# EAGLE design ESC (EAGLE 9.1.2)
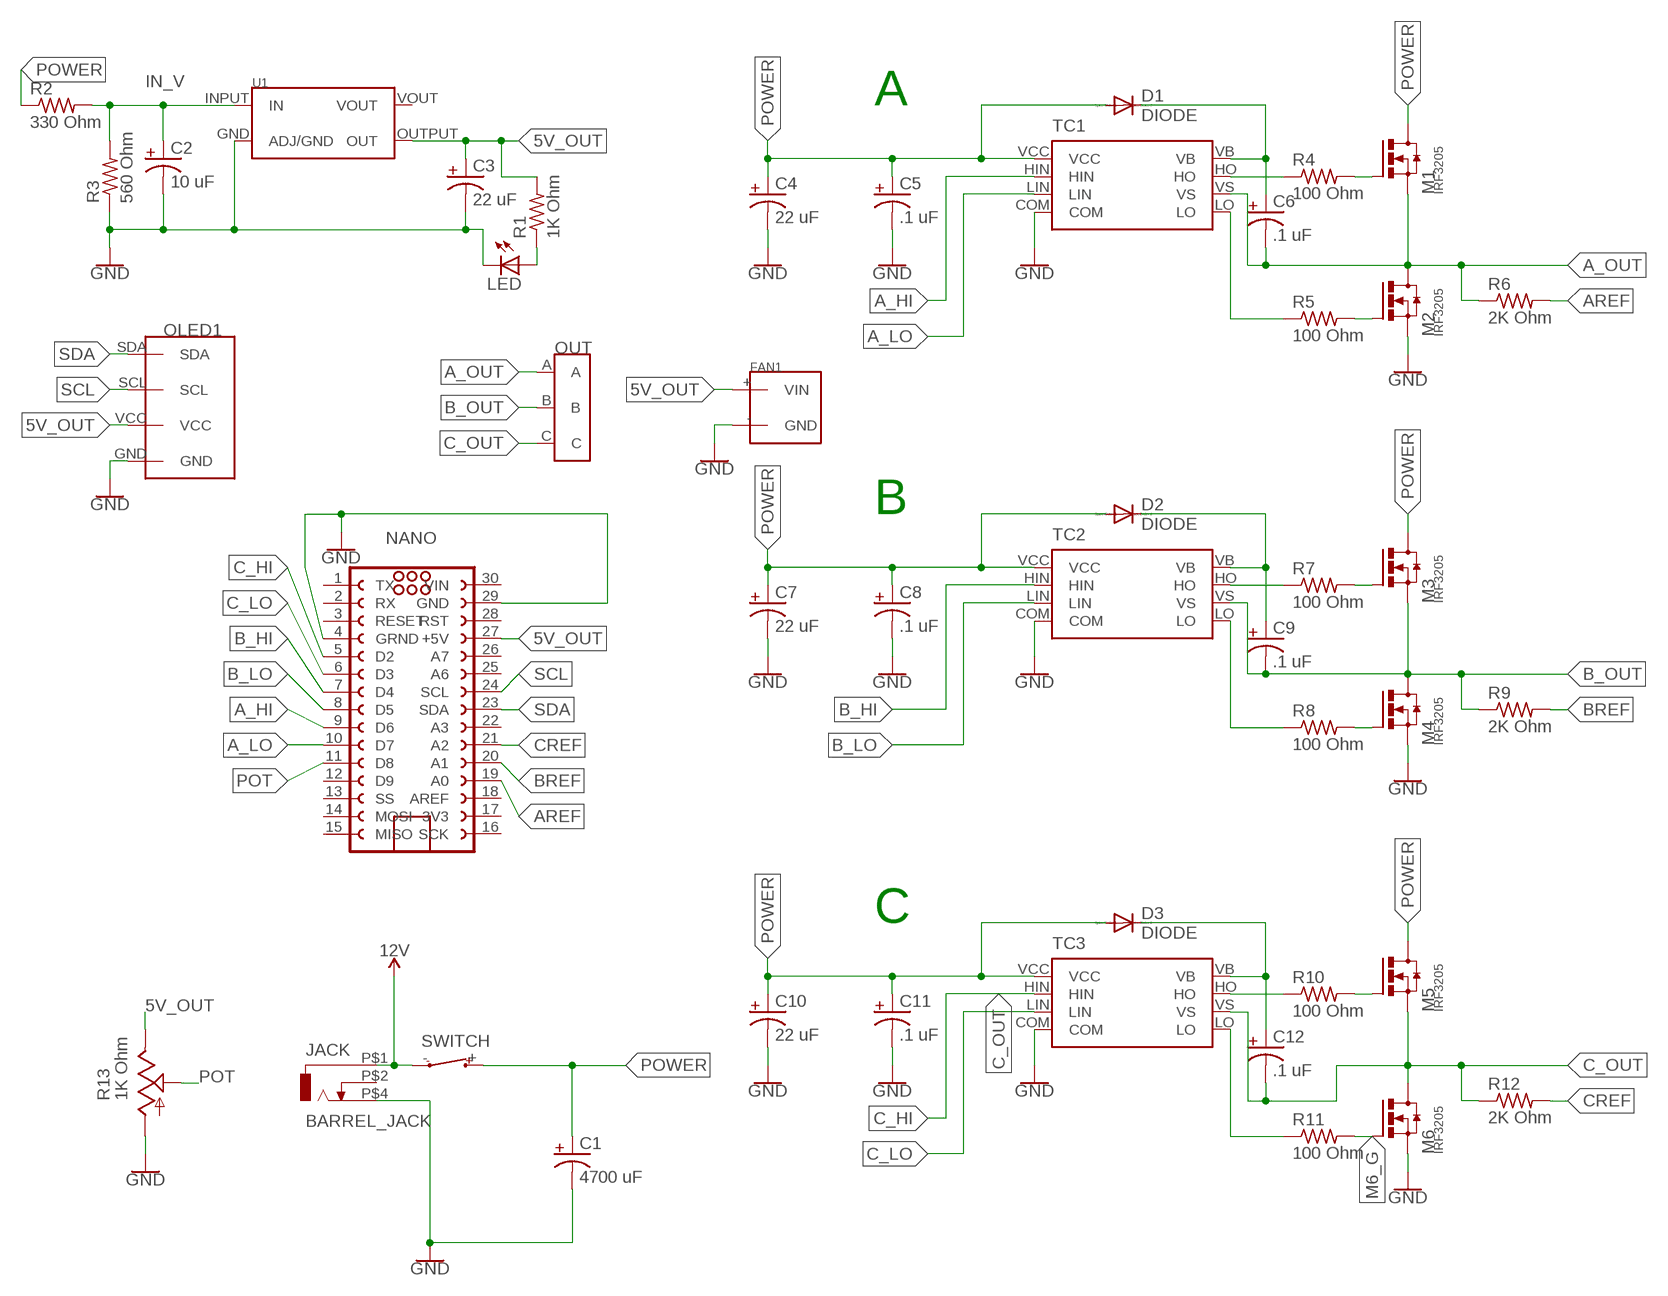
[diagram p0: schematic, sheet 1]

## Parts
C1  4700 uF  CAPACITORLARGE  [CAP_LARGE]
C2  10 uF  CAPACITOR  [0805]
C3  22 uF  CAPACITOR  [0805]
C4  22 uF  CAPACITOR  [0805]
C5  .1 uF  CAPACITOR  [0805]
C6  .1 uF  CAPACITOR  [0805]
C7  22 uF  CAPACITOR  [0805]
C8  .1 uF  CAPACITOR  [0805]
C9  .1 uF  CAPACITOR  [0805]
C10  22 uF  CAPACITOR  [0805]
C11  .1 uF  CAPACITOR  [0805]
C12  .1 uF  CAPACITOR  [0805]
D1  DIODE  [DIODE]
D2  DIODE  [DIODE]
D3  DIODE  [DIODE]
FAN1  2P_POWER  [2P_POWER]
JACK  BARREL_JACK  [BARREL_JACK]
LED  LED  [LED_PADS]
M1  IRF3205  [IRF3205]
M2  IRF3205  [IRF3205]
M3  IRF3205  [IRF3205]
M4  IRF3205  [IRF3205]
M5  IRF3205  [IRF3205]
M6  IRF3205  [IRF3205]
NANO  ARDUINO_NANO_CONNECTOR  [ARDUINO_NANO_HEADER]
OLED1  I2C_OLED_4PIN_HEADER  [OLED_CONNECTION]
OUT  TERMINAL3  [3PIN_TERMINAL]
R1  1K Ohm  RESISTOR0805  [0805]
R2  330 Ohm  RESISTOR  [RESISTOR]
R3  560 Ohm  RESISTOR  [RESISTOR]
R4  100 Ohm  RESISTOR0805  [0805]
R5  100 Ohm  RESISTOR0805  [0805]
R6  2K Ohm  RESISTOR0805  [0805]
R7  100 Ohm  RESISTOR0805  [0805]
R8  100 Ohm  RESISTOR0805  [0805]
R9  2K Ohm  RESISTOR0805  [0805]
R10  100 Ohm  RESISTOR0805  [0805]
R11  100 Ohm  RESISTOR0805  [0805]
R12  2K Ohm  RESISTOR0805  [0805]
R13  1K Ohm  POT  [POT]
SWITCH  BOAT_SWITCH  [2P_POWER]
TC1  TSC428CPA  [PDIP-8_N]
TC2  TSC428CPA  [PDIP-8_N]
TC3  TSC428CPA  [PDIP-8_N]
U1  AZ1117CH  [AZ1117CH]

## Nets
5V_OUT: C3.1(ANODE) FAN1.+(VIN) NANO.27(+5V) OLED1.VCC R1.2 R13.+ U1.OUTPUT(OUT)
12V: JACK.P$1 SWITCH.-
A_HI: NANO.9(D6) TC1.HIN
A_LO: NANO.10(D7) TC1.LIN
A_OUT: C6.2(CATHODE) M1.SOURCE(S) M2.DRAIN(D) OUT.A R6.1 TC1.VS
AREF: NANO.19(A0) R6.2
B_HI: NANO.7(D4) TC2.HIN
B_LO: NANO.8(D5) TC2.LIN
B_OUT: C9.2(CATHODE) M3.SOURCE(S) M4.DRAIN(D) OUT.B R9.1 TC2.VS
BREF: NANO.20(A1) R9.2
C_HI: NANO.5(D2) TC3.HIN
C_LO: NANO.6(D3) TC3.LIN
C_OUT: C12.2(CATHODE) M5.SOURCE(S) M6.DRAIN(D) OUT.C R12.1 TC3.VS
CREF: NANO.21(A2) R12.2
GND: C1.CATHODE C2.2(CATHODE) C3.2(CATHODE) C4.2(CATHODE) C5.2(CATHODE) C7.2(CATHODE) C8.2(CATHODE) C10.2(CATHODE) C11.2(CATHODE) FAN1.-(GND) JACK.P$4 LED.C M2.SOURCE(S) M4.SOURCE(S) M6.SOURCE(S) NANO.4(GRND) NANO.29(GND) OLED1.GND R3.P$1 R13.- TC1.COM TC2.COM TC3.COM U1.GND(ADJ/GND)
IN_V: C2.1(ANODE) R2.P$2 R3.P$2 U1.INPUT(IN)
M6_G: M6.GATE(G) R11.2
N$1: M2.GATE(G) R5.2
N$2: LED.A R1.1
N$3: R4.1 TC1.HO
N$4: M1.GATE(G) R4.2
N$6: R5.1 TC1.LO
N$11: C6.1(ANODE) D1.C TC1.VB
N$12: M3.GATE(G) R7.2
N$14: M4.GATE(G) R8.2
N$17: R7.1 TC2.HO
N$18: R8.1 TC2.LO
N$19: C9.1(ANODE) D2.C TC2.VB
N$22: M5.GATE(G) R10.2
N$27: R10.1 TC3.HO
N$28: R11.1 TC3.LO
N$29: C12.1(ANODE) D3.C TC3.VB
POT: NANO.11(D8) R13.VAR
POWER: C1.ANODE C4.1(ANODE) C5.1(ANODE) C7.1(ANODE) C8.1(ANODE) C10.1(ANODE) C11.1(ANODE) D1.A D2.A D3.A M1.DRAIN(D) M3.DRAIN(D) M5.DRAIN(D) R2.P$1 SWITCH.+ TC1.VCC TC2.VCC TC3.VCC
SCL: NANO.24(SCL) OLED1.SCL
SDA: NANO.23(SDA) OLED1.SDA
Unconnected: JACK.P$2 NANO.1(TX) NANO.2(RX) NANO.3(RESET) NANO.12(D9) NANO.13(SS) NANO.14(MOSI) NANO.15(MISO) NANO.16(SCK) NANO.18(AREF) NANO.22(A3) NANO.25(A6) NANO.26(A7) NANO.28(RST) NANO.30(VIN) U1.VOUT

## Notes on the sheet
- A
- B
- C

## Power pins joined to a net without a drawn wire
3V3: NANO.17(3V3)

## Library data of the parts
C1-C12 = TRANS_IRF3205SPBF:CAPACITOR
D1-D3 = TRANS_IRF3205SPBF:DIODE
FAN1 = TRANS_IRF3205SPBF:2P_POWER
JACK = TRANS_IRF3205SPBF:BARREL_JACK
LED = TRANS_IRF3205SPBF:LED
M1-M6 = TRANS_IRF3205SPBF:IRF3205
NANO = TRANS_IRF3205SPBF:ARDUINO_NANO_CONNECTOR
OLED1 = TRANS_IRF3205SPBF:I2C_OLED_4PIN_HEADER
OUT = TRANS_IRF3205SPBF:TERMINAL3
R1-R12 = TRANS_IRF3205SPBF:RESISTOR
R13 = TRANS_IRF3205SPBF:POT
SWITCH = TRANS_IRF3205SPBF:BOAT_SWITCH
TC1-TC3 = TRANS_IRF3205SPBF:TSC428CPA
U1 = TRANS_IRF3205SPBF:AZ1117CH

## Board
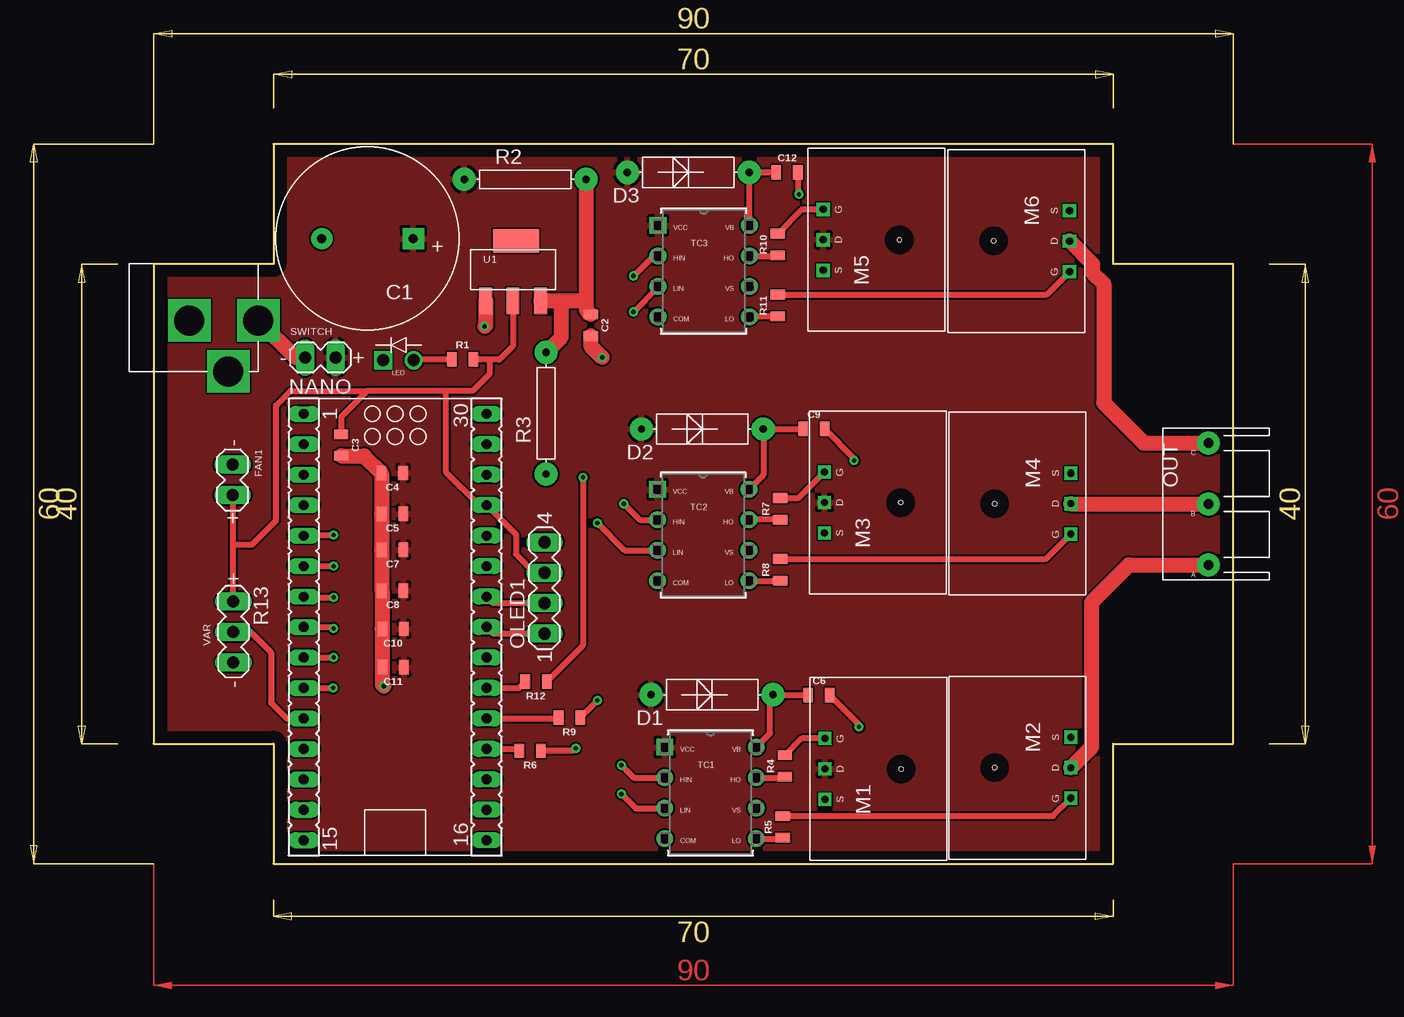
[diagram p1: board, top side]
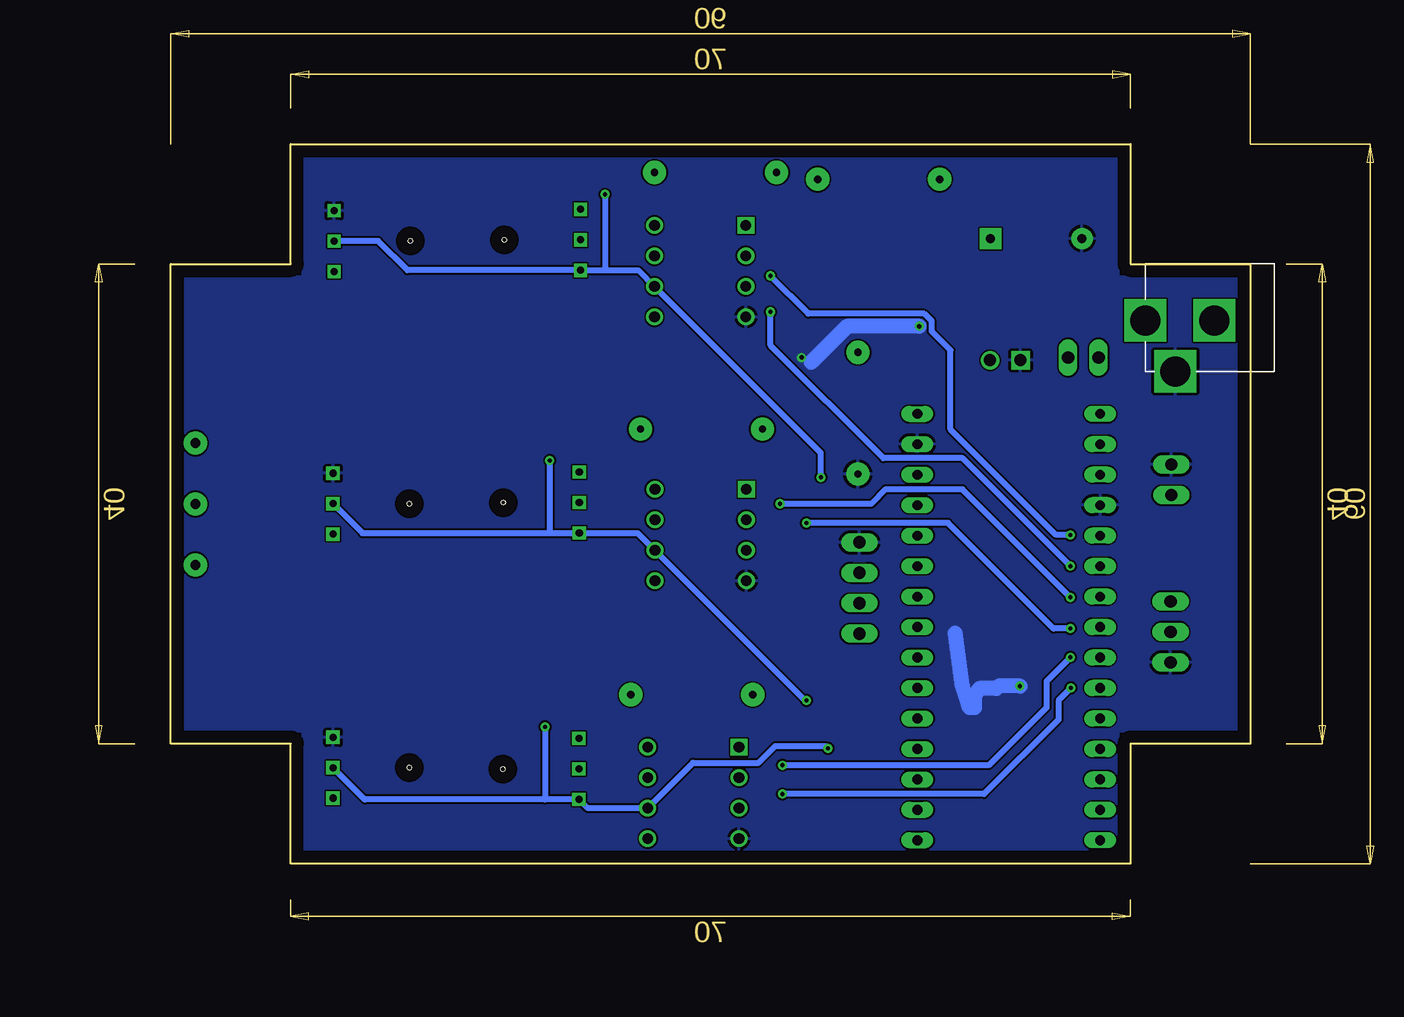
[diagram p2: board, bottom side, seen from below]

Size 90 x 60 mm. Coordinates in mm from the lower left corner, seen from the top.
Outline: 0,50 0,10 10,10 10,0 80,0 80,10 90,10 90,50 80,50 80,60 10,60 10,50 0,50
Copper layers (1*16): Top 0.035mm / dielectric 1.5mm / Bottom 0.035mm
Design rules "default": minimum track width 6mil, minimum drill 0.35mm, track to track 6mil, track to pad 6mil, pad to pad 6mil, via to via 6mil, smd to smd 6mil, copper to edge 40mil, drill to drill 6mil, minimum pad ring 10mil, minimum via ring 8mil, stop-mask expansion 4mil, vias tented up to drill 0mil, thermal gap 10mil

### Footprints (pad centres in the part's own frame; a part is rotated, then mirrored left to right if it is on the bottom)
CAP_LARGE = drill 0.75 pad 1.778 square: ANODE -3.81,0 | drill 0.75 pad 1.778: CATHODE 3.81,0
0805 = smd 0.8 x 1.2: 1 -0.9,0; 2 0.9,0
DIODE = drill 0.6 pad 1.93: A -5.08,0; C 5.08,0
2P_POWER = drill 1.016 long: + -3.81,0; - -1.27,0
BARREL_JACK = drill 2.5 square: P$1 5.75,0; P$2 0,0; P$4 3.25,-4.25
LED_PADS = drill 1: A 1.27,0 | drill 1 square: C -1.27,0
IRF3205 = drill 0.6 square: DRAIN 0,0; GATE 2.54,0; SOURCE -2.54,0 | hole 0.35: 0,-6.35
ARDUINO_NANO_HEADER = drill 0.813 long: 1 -7.62,19.05; 2 -7.62,16.51; 3 -7.62,13.97; 4 -7.62,11.43; 5 -7.62,8.89; 6 -7.62,6.35; 7 -7.62,3.81; 8 -7.62,1.27; 9 -7.62,-1.27; 10 -7.62,-3.81; 11 -7.62,-6.35; 12 -7.62,-8.89; 13 -7.62,-11.43; 14 -7.62,-13.97; 15 -7.62,-16.51; 16 7.62,-16.51; 17 7.62,-13.97; 18 7.62,-11.43; 19 7.62,-8.89; 20 7.62,-6.35; 21 7.62,-3.81; 22 7.62,-1.27; 23 7.62,1.27; 24 7.62,3.81; 25 7.62,6.35; 26 7.62,8.89; 27 7.62,11.43; 28 7.62,13.97; 29 7.62,16.51; 30 7.62,19.05
OLED_CONNECTION = drill 1.016 long: GND 3.81,0; SCL -1.27,0; SDA -3.81,0; VCC 1.27,0
3PIN_TERMINAL = drill 0.8 pad 1.93: A 1.27,5.08; B 1.27,0; C 1.27,-5.08
RESISTOR = drill 0.6 pad 1.93: P$1 -5.08,0; P$2 5.08,0
POT = drill 1.016 long: + -3.81,0; - 1.27,0; VAR -1.27,0
PDIP-8_N = drill 0.889 pad 1.397: COM -3.81,-3.81; HIN -3.81,1.27; HO 3.81,1.27; LIN -3.81,-1.27; LO 3.81,-3.81; VB 3.81,3.81; VS 3.81,-1.27 | drill 0.889 pad 1.397 square: VCC -3.81,3.81
AZ1117CH = smd 1.067 x 2.184: GND -2.286,-2.6; INPUT 2.3,-2.6; OUTPUT -0.014,-2.6 | smd 3.81 x 1.93: VOUT 0.25,2.4

### Placement (x,y rotation side)
C1  17.84,52.11 180 top
C2  36.44,44.88 270 top
C3  15.64,34.89 270 top
C4  19.9,32.56 180 top
C5  19.91,29.16 180 top
C6  55.48,14.04 0 top
C7  19.93,26.16 180 top
C8  19.94,22.76 180 top
C9  55.05,36.24 0 top
C10  19.96,19.56 180 top
C11  19.97,16.36 180 top
C12  52.82,57.64 0 top
D1  46.56,14.08 0 top
D2  45.75,36.23 0 top
D3  44.58,57.63 0 top
FAN1  6.59,34.53 90 top
JACK  2.99,45.29 0 top
LED  20.42,41.96 0 top
M1  55.97,7.89 90 top
M2  76.47,7.99 270 top
M3  55.93,30.1 90 top
M4  76.47,30.01 270 top
M5  55.83,52.01 90 top
M6  76.37,51.9 270 top
NANO  20.14,18.45 0 top
OLED1  32.59,22.98 90 top
OUT  89.21,29.98 180 top
R1  25.76,42.04 0 top
R2  30.98,57.05 0 top
R3  32.72,37.55 90 top
R4  52.64,8.14 90 top
R5  52.44,3.06 90 top
R6  31.4,9.4 180 top
R7  52.24,29.58 90 top
R8  52.24,24.5 90 top
R9  34.66,12.16 180 top
R10  52.04,51.62 90 top
R11  52.04,46.54 90 top
R12  31.87,15.16 180 top
R13  6.65,18.05 270 top
SWITCH  11.38,42.19 180 top
TC1  46.43,5.89 0 top
TC2  45.82,27.39 0 top
TC3  45.86,49.39 0 top
U1  29.97,49.52 0 top

### Tracks (layer width: path | path; a pad name or v marks a point on that pad's centre or on a via)
5V_OUT
  Top 0.508: U1.OUTPUT 29.96,43.16 28.8,42 28.76,42.04 28,42.04 | 28,42.04 R1.2 | 28,42.04 28,40.8 26.6,39.4 24.4,39.4 | 24.4,39.4 17.8,39.4 | C3.1 15.64,37.24 17.8,39.4 | 24.4,39.4 24.4,32.6 27.12,29.88 NANO.27 30.2,27.44 30.2,25.8 31.8,24.2 31.85,24.25 OLED1.VCC | R13.+ 6.65,26.6 | 6.65,26.6 6.65,30.66 FAN1.+ | 6.65,26.6 8.2,26.6 10.2,28.6 10.2,38.2 11.4,39.4 17.8,39.4
12V
  Top 1.27: JACK.P$1 11.84,42.19 SWITCH.-
A_HI  (via drill 0.35)
  Top 0.508: NANO.9 14.98,17.18 v15,17.2 | v39,8.2 40.04,7.16 TC1.HIN
  Bottom 0.508: v15,17.2 17,15.2 17,13 21.8,8.2 v39,8.2
A_LO  (via drill 0.35)
  Top 0.508: NANO.10 v14.96,14.64 15,14.6 | v39,5.8 40.2,4.6 42.6,4.6 TC1.LIN
  Bottom 0.508: v14.96,14.64 16,13.6 16,12 22.2,5.8 v39,5.8
A_OUT  (via drill 0.35)
  Top 0.508: v35.2,9.6 35,9.4 R6.1 | C6.2 58.8,11.62 v58.8,11.4
  Top 1.27: M2.DRAIN 78.2,9.72 78.2,21.8 81.3,24.9 OUT.A
  Bottom 0.508: v35.2,9.6 35.4,9.8 39.6,9.8 41,8.4 46.46,8.4 TC1.VS 55.24,4.62 M1.SOURCE 58.8,5.35 | 58.8,5.35 73.83,5.35 M2.DRAIN | v58.8,11.4 58.8,5.35
AREF
  Top 0.508: NANO.19 30.34,9.56 R6.2
B_HI  (via drill 0.35)
  Top 0.508: NANO.7 12.58,22.2 v15,22.2 | v39.2,30 40.54,28.66 TC2.HIN
  Bottom 0.508: v15,22.2 24,31.2 30.4,31.2 31.6,30 v39.2,30
B_LO  (via drill 0.35)
  Top 0.508: NANO.8 14.88,19.72 v15,19.6 | v37,28.4 39.28,26.12 TC2.LIN
  Bottom 0.508: v15,19.6 16.4,19.6 25.21,28.41 28.86,28.41 28.87,28.4 v37,28.4
B_OUT  (via drill 0.35)
  Top 0.508: C9.2 58.4,33.79 v58.4,33.6 | v37,13.6 R9.1
  Top 1.27: M4.DRAIN 76.5,29.98 OUT.B
  Bottom 0.508: M4.DRAIN 74.02,27.56 58.4,27.56 | 58.4,27.56 M3.SOURCE | v58.4,33.6 58.4,27.56 | M3.SOURCE 51.07,27.56 TC2.VS 37.11,13.6 v37,13.6 | 58.4,27.56 M3.SOURCE
BREF
  Top 0.508: NANO.20 33.7,12.1 R9.2
C_HI  (via drill 0.35)
  Top 0.508: NANO.5 12.58,27.4 v15,27.4 | v40,49 41.66,50.66 TC3.HIN
  Bottom 0.508: v15,27.4 16.2,27.4 25,36.2 25,42.81 26.56,44.37 26.56,45.23 27.17,45.84 36.84,45.84 v40,49
C_LO  (via drill 0.35)
  Top 0.508: NANO.6 v15,24.8 | v40,46 42.05,48.05 TC3.LIN
  Bottom 0.508: v15,24.8 24,33.8 30.6,33.8 40,43.2 v40,46
C_OUT  (via drill 0.35)
  Top 0.508: v35.8,32.2 35.8,18.19 R12.1 | C12.2 53.72,55.88 v53.8,55.8
  Top 1.27: OUT.C 82.54,35.06 79.2,38.4 79.2,48.36 78.27,49.28 78.27,50 M6.DRAIN
  Bottom 0.508: v35.8,32.2 35.8,34.25 TC3.VS 51.02,49.47 53.8,49.47 | 53.8,49.47 M5.SOURCE 70.27,49.47 72.7,51.9 M6.DRAIN | v53.8,55.8 53.8,49.47
CREF
  Top 0.508: NANO.21 30.45,14.64 R12.2
GND  (via drill 0.35)
  Top 1.27: C3.2 17.57,33.99 C4.2 C5.2 19.01,26.18 C7.2 C8.2 19.04,19.58 C10.2 C11.2 19.07,14.93 v19.2,14.8 | U1.GND 27.68,44.88 v27.6,44.8 | C2.2 36.44,43.16 v37.4,42.2
  Bottom 1.27: v27.6,44.8 33.6,44.8 36.6,41.8 | v19.2,14.8 21,14.8 21.2,14.6 22.6,14.6 23,14 23,13 23.4,13 24,14.8 24.6,19.2
  pour Bottom: 11,59 11,49 1,49 1,11 11,11 11,1 79,1 79,11 89,11 89,14.6 89,49 79,49 79,59
IN_V
  Top 1.27: R2.P$2 36.06,46.8 | 36.06,46.8 36.06,46.16 C2.1 | U1.INPUT 34,46.92 | 34,46.92 35.94,46.92 36.06,46.8 | R3.P$2 34,43.91 34,46.92
M6_G
  Top 0.508: R11.2 74.45,47.44 M6.GATE
N$1
  Top 0.508: R5.2 74.98,3.96 M2.GATE
N$2
  Top 0.508: R1.1 21.69,42.04 LED.A
N$3
  Top 0.508: TC1.HO 52.56,7.16 R4.1
N$4
  Top 0.508: M1.GATE 54.03,10.43 R4.2
N$6
  Top 0.508: TC1.LO 52.36,2.08 R5.1
N$11
  Top 0.508: C6.1 54.54,14.08 D1.C 51.4,13.84 51.4,10.86 TC1.VB
N$12
  Top 0.508: R7.2 53.77,30.48 M3.GATE
N$14
  Top 0.508: R8.2 74.4,25.4 M4.GATE
N$17
  Top 0.508: R7.1 49.65,28.68 TC2.HO
N$18
  Top 0.508: TC2.LO 52.22,23.58 R8.1
N$19
  Top 0.508: C9.1 D2.C 50.83,32.4 TC2.VB
N$22
  Top 0.508: R10.2 54.07,54.55 M5.GATE
N$27
  Top 0.508: TC3.HO 51.98,50.66 R10.1
N$28
  Top 0.508: TC3.LO 49.73,45.64 R11.1
N$29
  Top 0.508: C12.1 D3.C TC3.VB
POT
  Top 0.508: R13.VAR 8.08,19.32 9.8,17.6 9.8,13.4 11.1,12.1 NANO.11
POWER
  pour Top: 1,49 11,49 11,59 79,59 79,49 89,49 89,11 79,11 79,1 11,1 11,11 1,11
SCL
  Top 0.508: NANO.24 28.31,21.71 OLED1.SCL
SDA
  Top 0.508: NANO.23 28.31,19.17 OLED1.SDA
(copper drawn outside any net)
  shapes: Top area x2